# EAGLE design Flowmeter_lpc1113 (EAGLE 6.3)

## Sheet 1 of 2
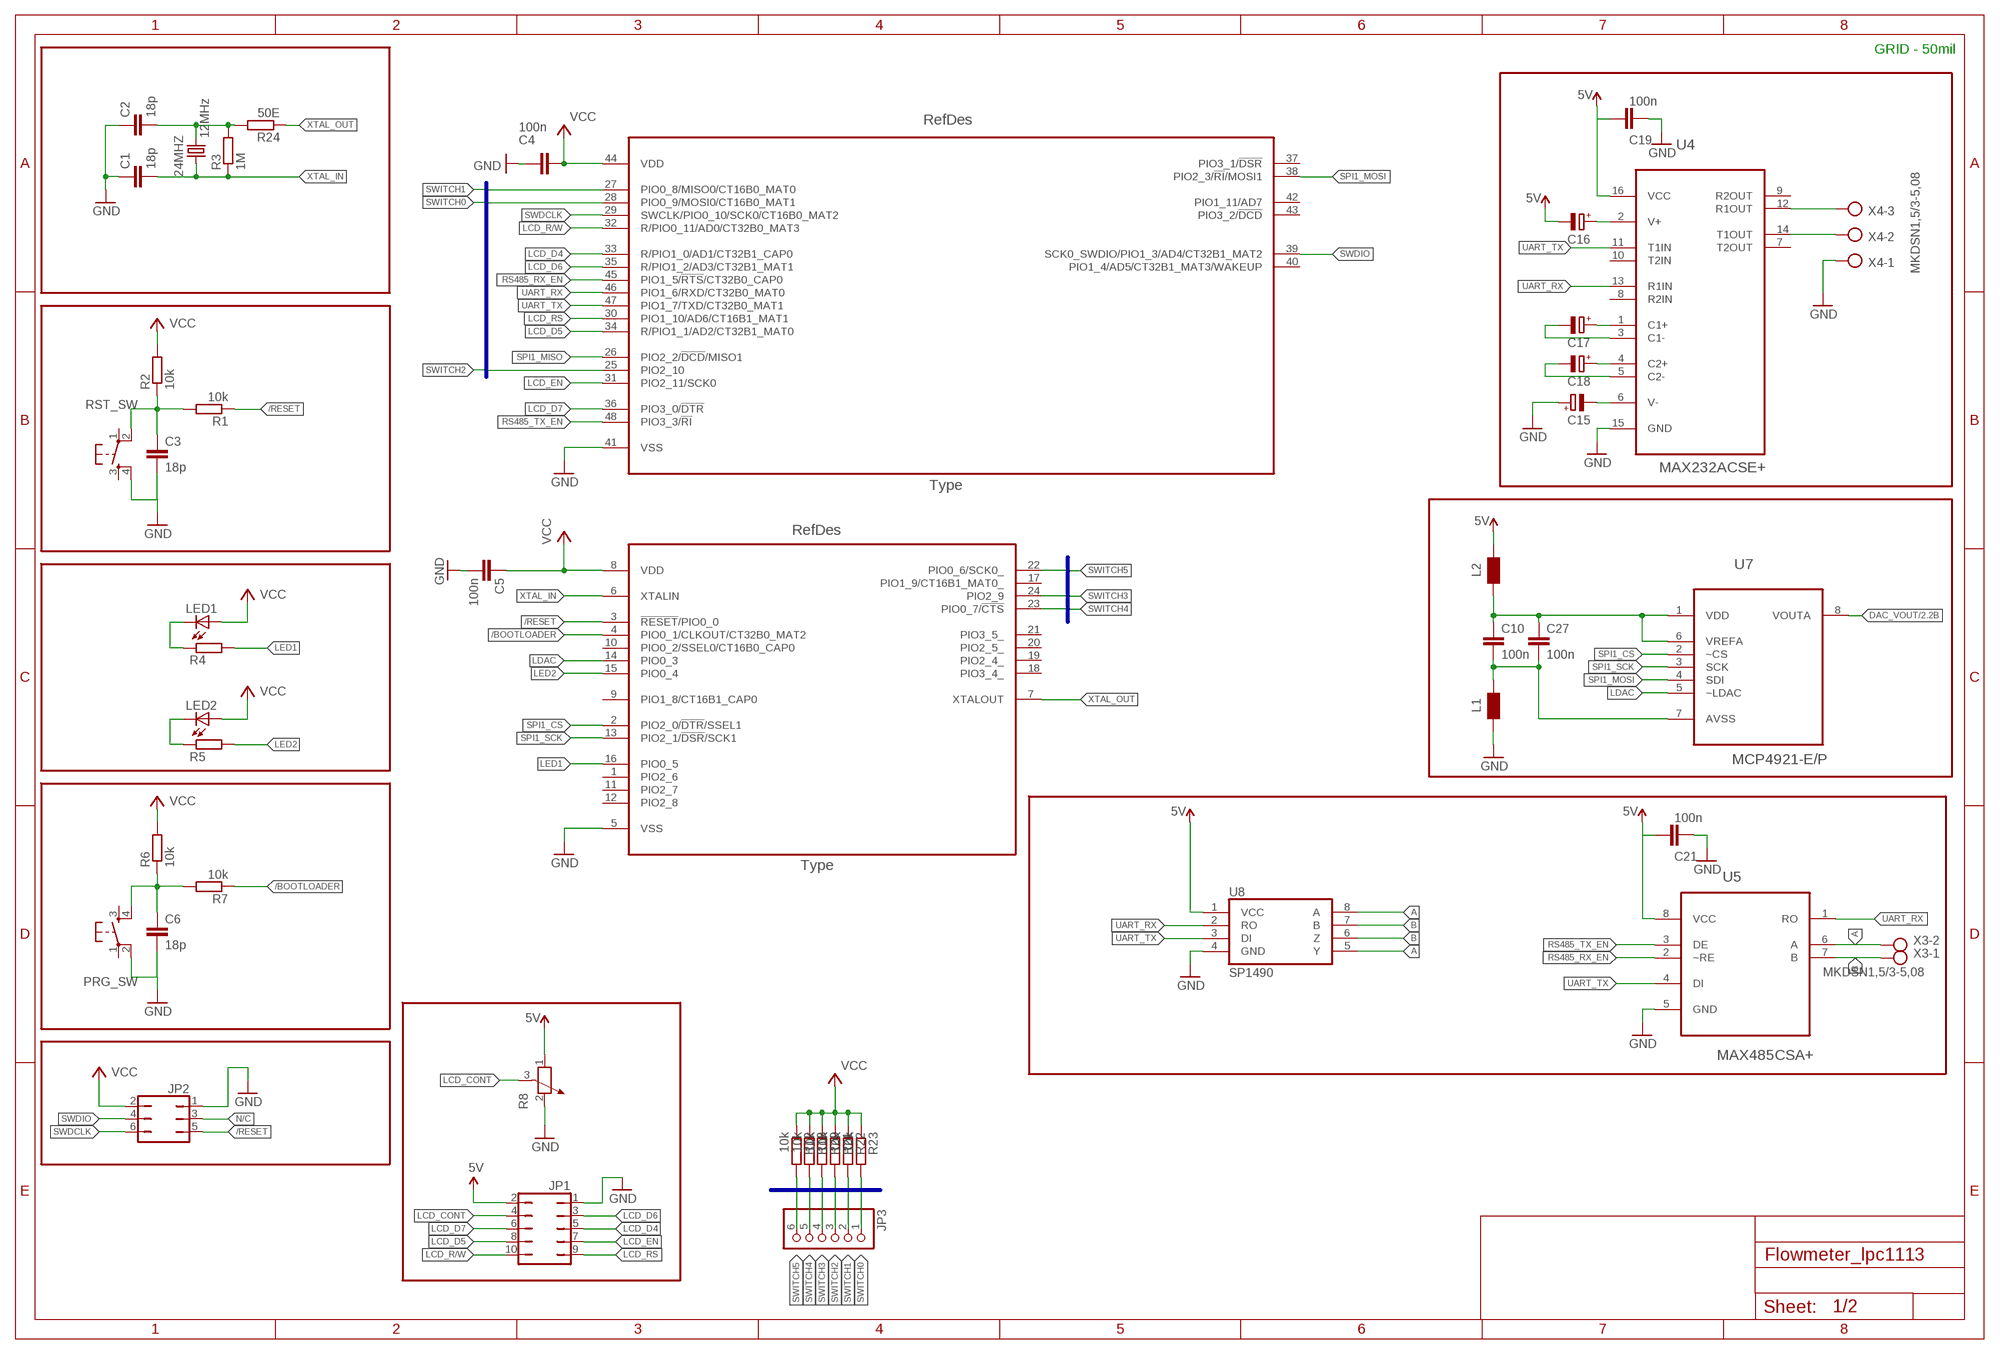
[diagram p0: schematic, sheet 1]

### Parts
24MHZ  12MHz  CRYSTALSMD  [HC49UP]
C1  18p  C-EUC0805K  [C0805K]
C2  18p  C-EUC0805K  [C0805K]
C3  18p  C-EUC0805K  [C0805K]
C4  100n  C-EUC0805K  [C0805K]
C5  100n  C-EUC0805K  [C0805K]
C6  18p  C-EUC0805K  [C0805K]
C10  100n  C-EUC0805K  [C0805K]
C15  CPOL-EUCT3528  [CT3528]
C16  CPOL-EUCT3528  [CT3528]
C17  CPOL-EUCT3528  [CT3528]
C18  CPOL-EUCT3528  [CT3528]
C19  100n  C-EUC0805K  [C0805K]
C21  100n  C-EUC0805K  [C0805K]
C27  100n  C-EUC0805K  [C0805K]
JP1  JP5Q  [JP5Q]
JP2  JP3Q  [JP3Q]
JP3  PINHD-1X6  [1X06]
L1  WURTH ELEKTRONIK - 742792095  WE-CBF_0805  [0805]
L2  WURTH ELEKTRONIK - 742792095  WE-CBF_0805  [0805]
LED1  LEDCHIP-LED0805  [CHIP-LED0805]
LED2  LEDCHIP-LED0805  [CHIP-LED0805]
PRG_SW  TAC_SWITCHPTH  [TACTILE-PTH]
R1  10k  R-EU_R0805W  [R0805W]
R2  10k  R-EU_R0805W  [R0805W]
R3  1M  R-EU_R0805W  [R0805W]
R4  R-EU_R0805  [R0805]
R5  R-EU_R0805  [R0805]
R6  10k  R-EU_R0805W  [R0805W]
R7  10k  R-EU_R0805W  [R0805W]
R8  POTENTIOMETER_PT-10S  [PT-10S]
R12  10k  R-EU_R0805W  [R0805W]
R13  10k  R-EU_R0805W  [R0805W]
R20  10k  R-EU_R0805W  [R0805W]
R21  10k  R-EU_R0805W  [R0805W]
R22  10k  R-EU_R0805W  [R0805W]
R23  10k  R-EU_R0805W  [R0805W]
R24  50E  R-EU_R0805W  [R0805W]
RST_SW  TAC_SWITCHPTH  [TACTILE-PTH]
U1  LPC1113FBD48/302,1  [QFP50P900X900X160-48N]
U4  MAX232ACSE+  [SOIC127P600X175-16N]
U5  MAX485CSA+  [SOIC127P600X175-8N]
U7  MCP4921-E/P  [DIP254P762X432-8]
U8  SP1490  [SO-08]
X3  MKDSN1,5/3-5,08  [MKDSN1,5/3-5,08]
X4  MKDSN1,5/3-5,08  [MKDSN1,5/3-5,08]

### Nets
5V: C16.- C19.2 C21.2 JP1.2 L2.2 R8.1 U4.16(VCC) U5.8(VCC) U8.1(VCC) ; also sheet 2
/BOOTLOADER: R7.1 U1.4(A:PIO0_1/CLKOUT/CT32B0_MAT2)
/RESET: JP2.5 R1.1 U1.3(A:!RESET!/PIO0_0)
A: U5.6(A) U8.5(Y) U8.8(A) X3.2
B: U5.7(B) U8.6(Z) U8.7(B) X3.1
DAC_VOUT: U7.8(VOUTA) ; also sheet 2
GND: C1.1 C2.1 C3.2 C4.2 C5.2 C6.2 C15.+ C19.1 C21.1 JP1.1 JP2.1 L1.1 PRG_SW.2 R8.2 RST_SW.4 U1.5(A:VSS) U1.41(B:VSS) U4.15(GND) U5.5(GND) U8.4(GND) X4.1 ; also sheet 2
GND1: C10.2 C27.2 L1.2 U7.7(AVSS)
LCD_CONT: JP1.4 R8.3
LCD_D4: JP1.5 U1.33(B:R/PIO1_0/AD1/CT32B1_CAP0)
LCD_D5: JP1.8 U1.34(B:R/PIO1_1/AD2/CT32B1_MAT0)
LCD_D6: JP1.3 U1.35(B:R/PIO1_2/AD3/CT32B1_MAT1)
LCD_D7: JP1.6 U1.36(B:PIO3_0/!DTR!)
LCD_EN: JP1.7 U1.31(B:PIO2_11/SCK0)
LCD_R/W: JP1.10 U1.32(B:R/PIO0_11/AD0/CT32B0_MAT3)
LCD_RS: JP1.9 U1.30(B:PIO1_10/AD6/CT16B1_MAT1)
LDAC: U1.14(A:PIO0_3) U7.5(~LDAC)
LED1: R4.2 U1.16(A:PIO0_5)
LED2: R5.2 U1.15(A:PIO0_4)
N$1: LED1.C R4.1
N$2: LED2.C R5.1
N$4: C3.1 R1.2 R2.1 RST_SW.2
N$5: C6.1 PRG_SW.4 R6.1 R7.2
N$6: 24MHZ.2 C2.2 R3.2 R24.2
N$11: C10.1 C27.1 L2.1 U7.1(VDD) U7.6(VREFA)
N$12: U4.14(T1OUT) X4.2
N$13: U4.12(R1OUT) X4.3
N$14: C17.+ U4.1(C1+)
N$24: C17.- U4.3(C1-)
N$26: C18.+ U4.4(C2+)
N$27: C18.- U4.5(C2-)
N$28: C16.+ U4.2(V+)
N$29: C15.- U4.6(V-)
N/C: JP2.3
RS485_RX_EN: U1.45(B:PIO1_5/!RTS!/CT32B0_CAP0) U5.2(~RE)
RS485_TX_EN: U1.48(B:PIO3_3/!RI!) U5.3(DE)
SPI1_CS: U1.2(A:PIO2_0/!DTR!/SSEL1) U7.2(~CS)
SPI1_MISO: U1.26(B:PIO2_2/!DCD!/MISO1)
SPI1_MOSI: U1.38(B:PIO2_3/!RI!/MOSI1) U7.4(SDI)
SPI1_SCK: U1.13(A:PIO2_1/!DSR!/SCK1) U7.3(SCK)
SWDCLK: JP2.6 U1.29(B:SWCLK/PIO0_10/SCK0/CT16B0_MAT2)
SWDIO: JP2.4 U1.39(B:SCK0_SWDIO/PIO1_3/AD4/CT32B1_MAT2)
SWITCH0: JP3.1 R23.2 U1.28(B:PIO0_9/MOSI0/CT16B0_MAT1)
SWITCH1: JP3.2 R22.2 U1.27(B:PIO0_8/MISO0/CT16B0_MAT0)
SWITCH2: JP3.3 R21.2 U1.25(B:PIO2_10)
SWITCH3: JP3.4 R20.2 U1.24(A:PIO2_9)
SWITCH4: JP3.5 R13.2 U1.23(A:PIO0_7/!CTS!)
SWITCH5: JP3.6 R12.2 U1.22(A:PIO0_6/SCK0_)
UART_RX: U1.46(B:PIO1_6/RXD/CT32B0_MAT0) U4.13(R1IN) U5.1(RO) U8.2(RO)
UART_TX: U1.47(B:PIO1_7/TXD/CT32B0_MAT1) U4.11(T1IN) U5.4(DI) U8.3(DI)
VCC: C4.1 C5.1 JP2.2 LED1.A LED2.A R2.2 R6.2 R12.1 R13.1 R20.1 R21.1 R22.1 R23.1 U1.8(A:VDD) U1.44(B:VDD) ; also sheet 2
XTAL_IN: 24MHZ.1 C1.2 R3.1 U1.6(A:XTALIN)
XTAL_OUT: R24.1 U1.7(A:XTALOUT)
Unconnected: PRG_SW.1 PRG_SW.3 RST_SW.1 RST_SW.3 U1.1(A:PIO2_6) U1.9(A:PIO1_8/CT16B1_CAP0) U1.10(A:PIO0_2/SSEL0/CT16B0_CAP0) U1.11(A:PIO2_7) U1.12(A:PIO2_8) U1.17(A:PIO1_9/CT16B1_MAT0_) U1.18(A:PIO3_4_) U1.19(A:PIO2_4_) U1.20(A:PIO2_5_) U1.21(A:PIO3_5_) U1.37(B:PIO3_1/!DSR!) U1.40(B:PIO1_4/AD5/CT32B1_MAT3/WAKEUP) U1.42(B:PIO1_11/AD7) U1.43(B:PIO3_2/!DCD!) U4.7(T2OUT) U4.8(R2IN) U4.9(R2OUT) U4.10(T2IN)

### Buses
SWITCH[0..5]

### Notes on the sheet
- GRID - 50mil

## Sheet 2 of 2
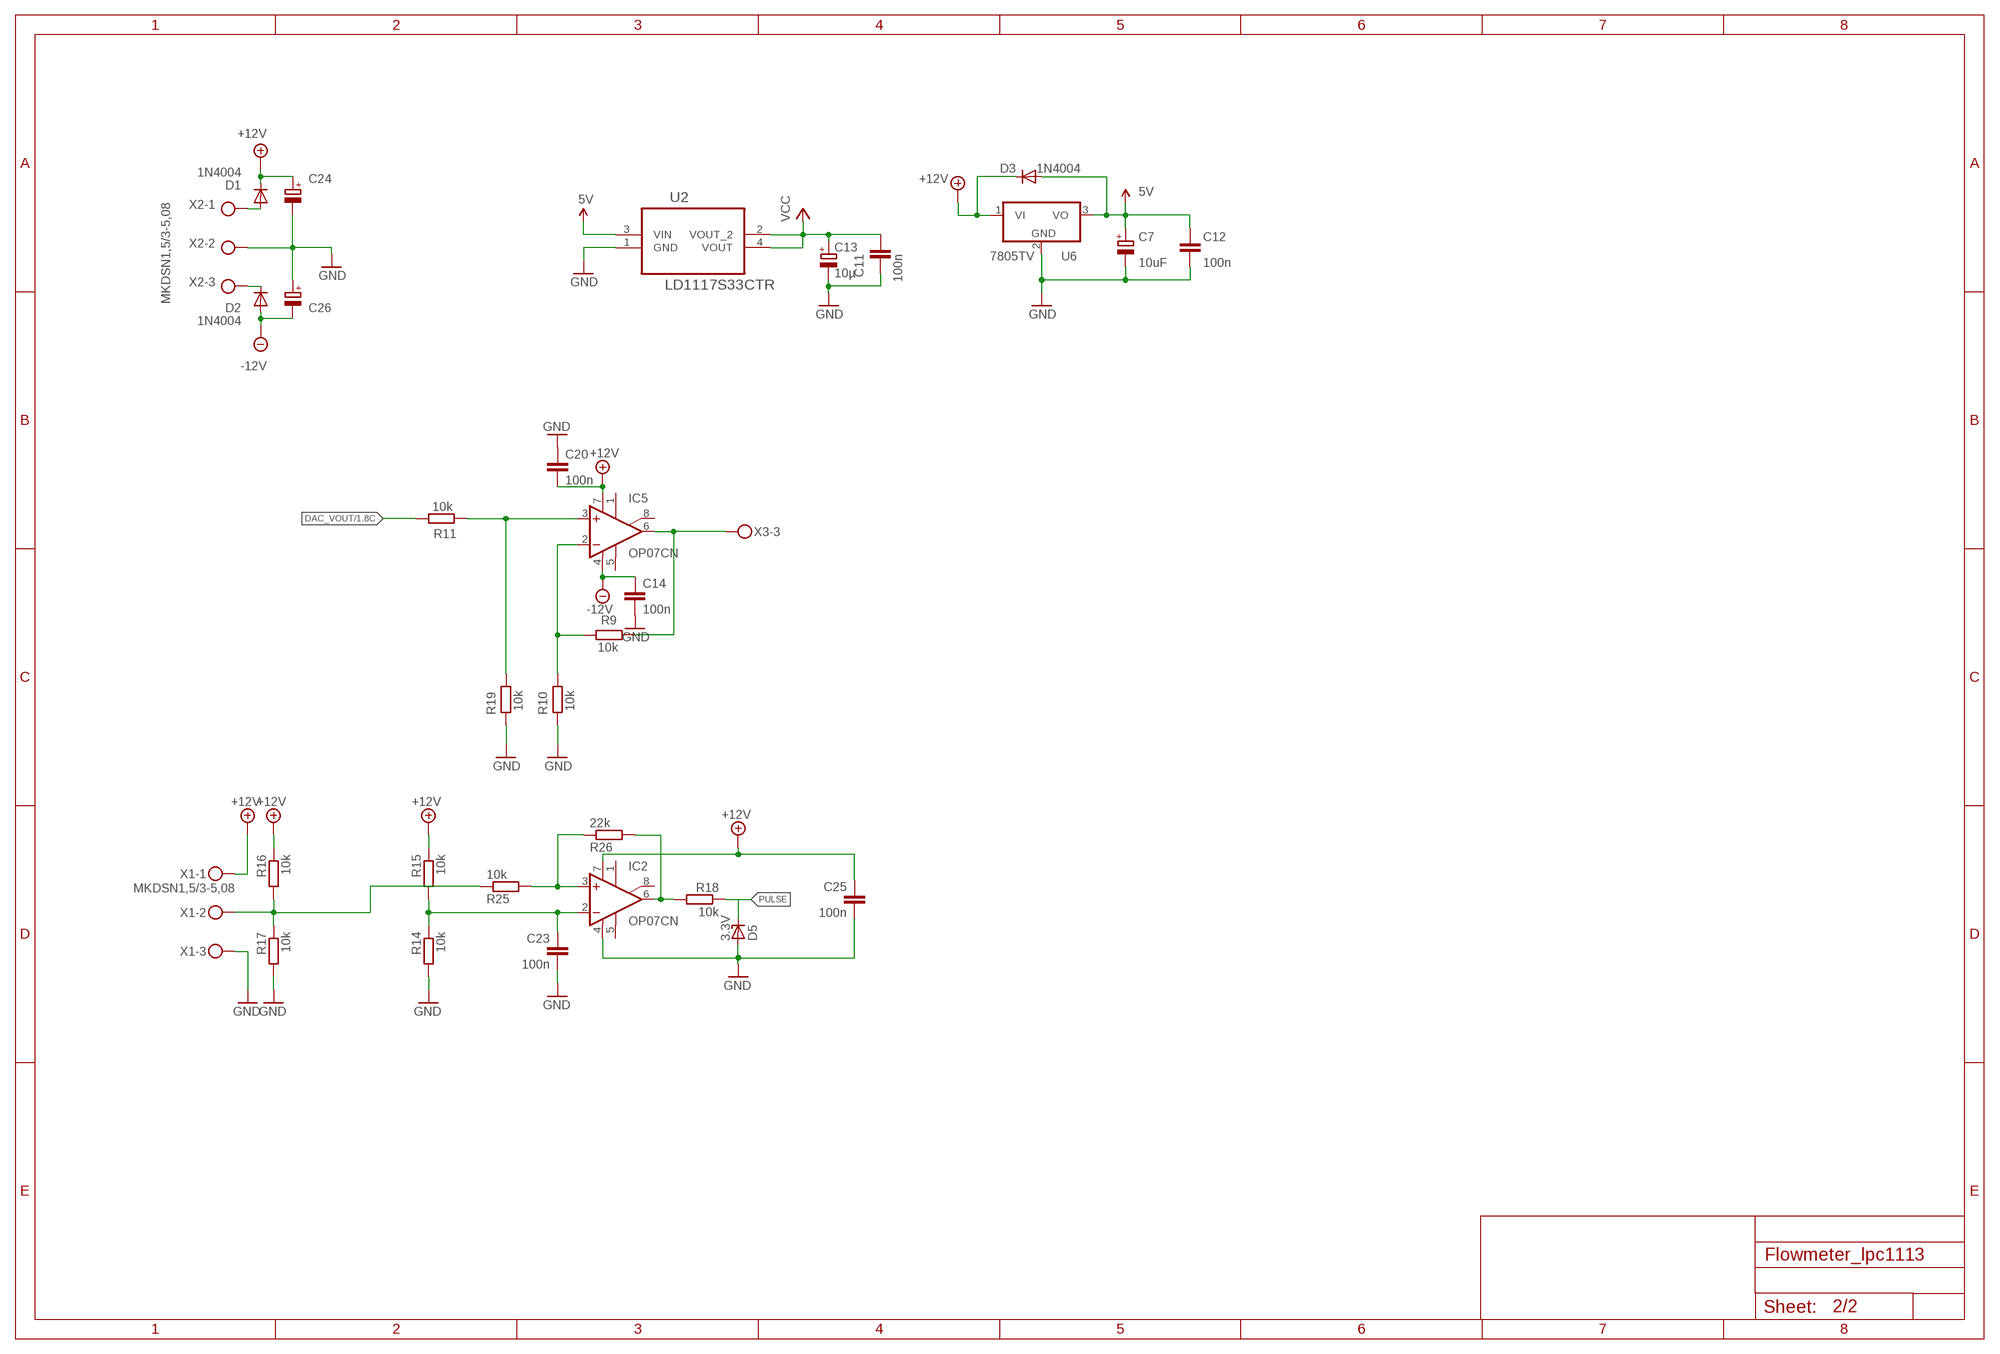
[diagram p1: schematic, sheet 2]

### Parts
C7  10uF  CPOL-EUE5-6  [E5-6]
C11  100n  C-EUC0805K  [C0805K]
C12  100n  C-EUC0805K  [C0805K]
C13  10µ  CPOL-EUCT3528  [CT3528]
C14  100n  C-EUC0805K  [C0805K]
C20  100n  C-EUC0805K  [C0805K]
C23  100n  C-EUC0805K  [C0805K]
C24  100uF/60V  CPOL-EUE5-6  [E5-6]
C25  100n  C-EUC0805K  [C0805K]
C26  100uF/60V  CPOL-EUE5-6  [E5-6]
D1  1N4004  [DO41-10]
D2  1N4004  [DO41-10]
D3  1N4004  [DO41-10]
D5  3.3V  ZENER_DIODEDO41Z10  [DO41Z10]
IC2  OP07CN  [DIL08]
IC5  OP07CN  [DIL08]
R9  10k  R-EU_0207/10  [0207/10]
R10  10k  R-EU_0207/10  [0207/10]
R11  10k  R-EU_0207/10  [0207/10]
R14  10k  R-EU_R0805W  [R0805W]
R15  10k  R-EU_R0805W  [R0805W]
R16  10k  R-EU_R0805W  [R0805W]
R17  10k  R-EU_R0805W  [R0805W]
R18  10k  R-EU_R0805W  [R0805W]
R19  10k  R-EU_0207/10  [0207/10]
R25  10k  R-EU_R0805W  [R0805W]
R26  22k  R-EU_R0805W  [R0805W]
U2  LD1117S33CTR  [SOT230P700X180-4N]
U6  7805TV  [TO220V]
X1  MKDSN1,5/3-5,08  [MKDSN1,5/3-5,08]
X2  MKDSN1,5/3-5,08  [MKDSN1,5/3-5,08]

### Nets
5V: C7.+ C12.2 D3.A U2.3(VIN) U6.3(VO) ; also sheet 1
+12V: C20.2 C24.+ C25.1 D1.C D3.C IC2.7(V+) IC5.7(V+) R15.1 R16.1 U6.1(VI) X1.1
-12V: C14.1 C26.- D2.A IC5.4(V-)
DAC_VOUT: R11.2 ; also sheet 1
GND: C7.- C11.1 C12.1 C13.- C14.2 C20.1 C23.2 C24.- C25.2 C26.+ D5.A(ANODE) IC2.4(V-) R10.1 R14.2 R17.2 R19.1 U2.1(GND) U6.2(GND) X1.3 X2.2 ; also sheet 1
N$7: IC2.3(+IN) R25.2 R26.1
N$15: C23.1 IC2.2(-IN) R14.1 R15.2
N$16: IC5.2(-IN) R9.1 R10.2
N$17: IC5.3(+IN) R11.1 R19.2
N$20: D2.C X2.3
N$21: D1.A X2.1
N$33: IC5.6(OUT) R9.2 X3.3
N$37: IC2.6(OUT) R18.2 R26.2
PULSE: D5.C(CATHODE) R18.1
SENSOR_SIGNAL: R16.2 R17.1 R25.1 X1.2
VCC: C11.2 C13.+ U2.2(VOUT_2) U2.4(VOUT) ; also sheet 1
Unconnected: IC2.1(ON1) IC2.5(OPT) IC2.8(ON2) IC5.1(ON1) IC5.5(OPT) IC5.8(ON2)

## Library data of the parts
24MHZ = SparkFun2:CRYSTAL: Crystals Various standard crystals. Proven footprints. Spark Fun Electronics SKU : Comp-XTAL
C1-C6 C10-C12 C14 C19-C21 C23 C25 C27 = rcl:C-EU: CAPACITOR, European symbol
C7 C13 C15-C18 C24 C26 = rcl:CPOL-EU: POLARIZED CAPACITOR, European symbol
D1-D3 = diode:1N4004: DIODE general purpose rectifier, 1 A
D5 = ng:ZENER_DIODE: zener diode
IC2 IC5 = linear:OP07*: OP AMP
JP1 = jumper:JP5Q: JUMPER
JP2 = jumper:JP3Q: JUMPER
JP3 = pinhead:PINHD-1X6: PIN HEADER
L1 L2 = wuerth-elektronik:WE-CBF: SMD EMI Suppression Ferrite Beads - excellent anti-EMI properties - low DCR - impedances till 3000 ohms - rated current up to 6 A
LED1 LED2 = led:LED: LED OSRAM: - CHIPLED LG R971, LG N971, LY N971, LG Q971, LY Q971, LO R971, LY R971 LH N974, LH R974 LS Q976, LO Q976, LY Q976 LO Q996 - Hyper CHIPLED LW Q18S LB Q993, LB Q99A, LB R99A - SideLED LS A670, LO A670, LY A670, LG A670, LP A670 LB A673, LV A673, LT A673, LW A673 LH A674 LY A675 LS A676, LA A676, LO A676, LY A676, LW A676 LS A679, LY A679, LG A679 - Hyper Micro SIDELED® LS Y876, LA Y876, LO Y876, LY Y876 LT Y87S - SmartLED LW L88C, LW L88S LB L89C, LB L89S, LG L890 LS L89K, LO L89K, LY L89K LS L896, LA L896, LO L896, LY L896 - TOPLED LS T670, LO T670, LY T670, LG T670, LP T670 LSG T670, LSP T670, LSY T670, LOP T670, LYG T670 LG T671, LOG T671, LSG T671 LB T673, LV T673, LT T673, LW T673 LH T674 LS T676, LA T676, LO T676, LY T676, LB T676, LH T676, LSB T676, LW T676 LB T67C, LV T67C, LT T67C, LS T67K, LO T67K, LY T67K, LW E67C LS E67B, LA E67B, LO E67B, LY E67B, LB E67C, LV E67C, LT E67C LW T67C LS T679, LY T679, LG T679 LS T770, LO T770, LY T770, LG T770, LP T770 LB T773, LV T773, LT T773, LW T773 LH T774 LS E675, LA E675, LY E675, LS T675 LS T776, LA T776, LO T776, LY T776, LB T776 LHGB T686 LT T68C, LB T68C - Hyper Mini TOPLED® LB M676 - Mini TOPLED Santana® LG M470 LS M47K, LO M47K, LY M47K Source: http://www.osram.convergy.de LUXEON: - LUMILED® LXK2-PW12-R00, LXK2-PW12-S00, LXK2-PW14-U00, LXK2-PW14-V00 LXK2-PM12-R00, LXK2-PM12-S00, LXK2-PM14-U00 LXK2-PE12-Q00, LXK2-PE12-R00, LXK2-PE12-S00, LXK2-PE14-T00, LXK2-PE14-U00 LXK2-PB12-K00, LXK2-PB12-L00, LXK2-PB12-M00, LXK2-PB14-N00, LXK2-PB14-P00, LXK2-PB14-Q00 LXK2-PR12-L00, LXK2-PR12-M00, LXK2-PR14-Q00, LXK2-PR14-R00 LXK2-PD12-Q00, LXK2-PD12-R00, LXK2-PD12-S00 LXK2-PH12-R00, LXK2-PH12-S00 LXK2-PL12-P00, LXK2-PL12-Q00, LXK2-PL12-R00 Source: www.luxeon.com KINGBRIGHT: KA-3528ASYC Source: www.kingbright.com
PRG_SW RST_SW = SparkFun1:TAC_SWITCH: Momentary Switch Button commonly used for reset or general input. Spark Fun Electronics SKU : COM-00097
R1-R7 R12-R18 R20-R26 = rcl:R-EU_: RESISTOR, European symbol
R8 = rcl:POTENTIOMETER_: Potentiometer
R9-R11 R19 = resistor:R-EU_: RESISTOR, European symbol
U1 = lpc1113:LPC1113FBD48/302,1: Embedded - Microcontrollers,LQFP-48; MPN: LPC1113FBD48/302,1; OC_FARNELL: 2072186; OC_NEWARK: 83T7137; PACKAGE: LQFP-48; SUPPLIER: NXP
U2 = ld1117:LD1117S33CTR: V REG, 1VDO, 0.8A, 3.3V, 4%, 3SOT223; MPN: LD1117S33CTR; OC_FARNELL: 2253482; OC_NEWARK: 89K0626; PACKAGE: SOT223-3; SUPPLIER: STMicroelectronics
U4 = maxim:MAX232ACSE+: +5V-Powered, Multichannel RS-232 Drivers/Receivers; MPN: MAX232ACSE+; OC_FARNELL: 9724362; OC_NEWARK: 52K5506; PACKAGE: SOIC-16; SUPPLIER: Maxim
U5 = maxim:MAX485CSA+: ±15kV ESD-Protected, Slew-Rate-Limited, Low-Power, RS-485/RS-422 Transceivers; MPN: MAX485CSA+; OC_FARNELL: 9725954; OC_NEWARK: 68K4795; PACKAGE: SOIC-8; SUPPLIER: Maxim
U6 = linear:78*: Positive VOLTAGE REGULATOR Source: http://cache.national.com/ds/LM/LM78L05.pdf http://www.fairchildsemi.com/ds/LM/LM7805.pdf
U7 = microchip:MCP4921-E/P: DAC; MPN: MCP4921-E/P; OC_FARNELL: 1332112; OC_NEWARK: 08J8743; PACKAGE: DIP-8; SUPPLIER: Microchip
U8 = exar:SP1490: Full Duplex RS-485 Transceiver
X1-X4 = con-phoenix-508:MKDSN1,5/3-5,08: MKDSN 1,5/ 3-5,08 Printklemme Nennstrom: 13,5 A Nennspannung: 250 V Rastermaß: 5,08 mm Polzahl: 3 Anschlussart: Schraubanschluss Montage: Löten Anschlussrichtung Leiter/Platine: 0 ° Artikelnummer: 1729131 Source: http://eshop.phoenixcontact.com .. 1729131.pdf; MPN: SMKDSN1,5/3-5,08; OC_FARNELL: 1792904; OC_NEWARK: 70R0299

## Board
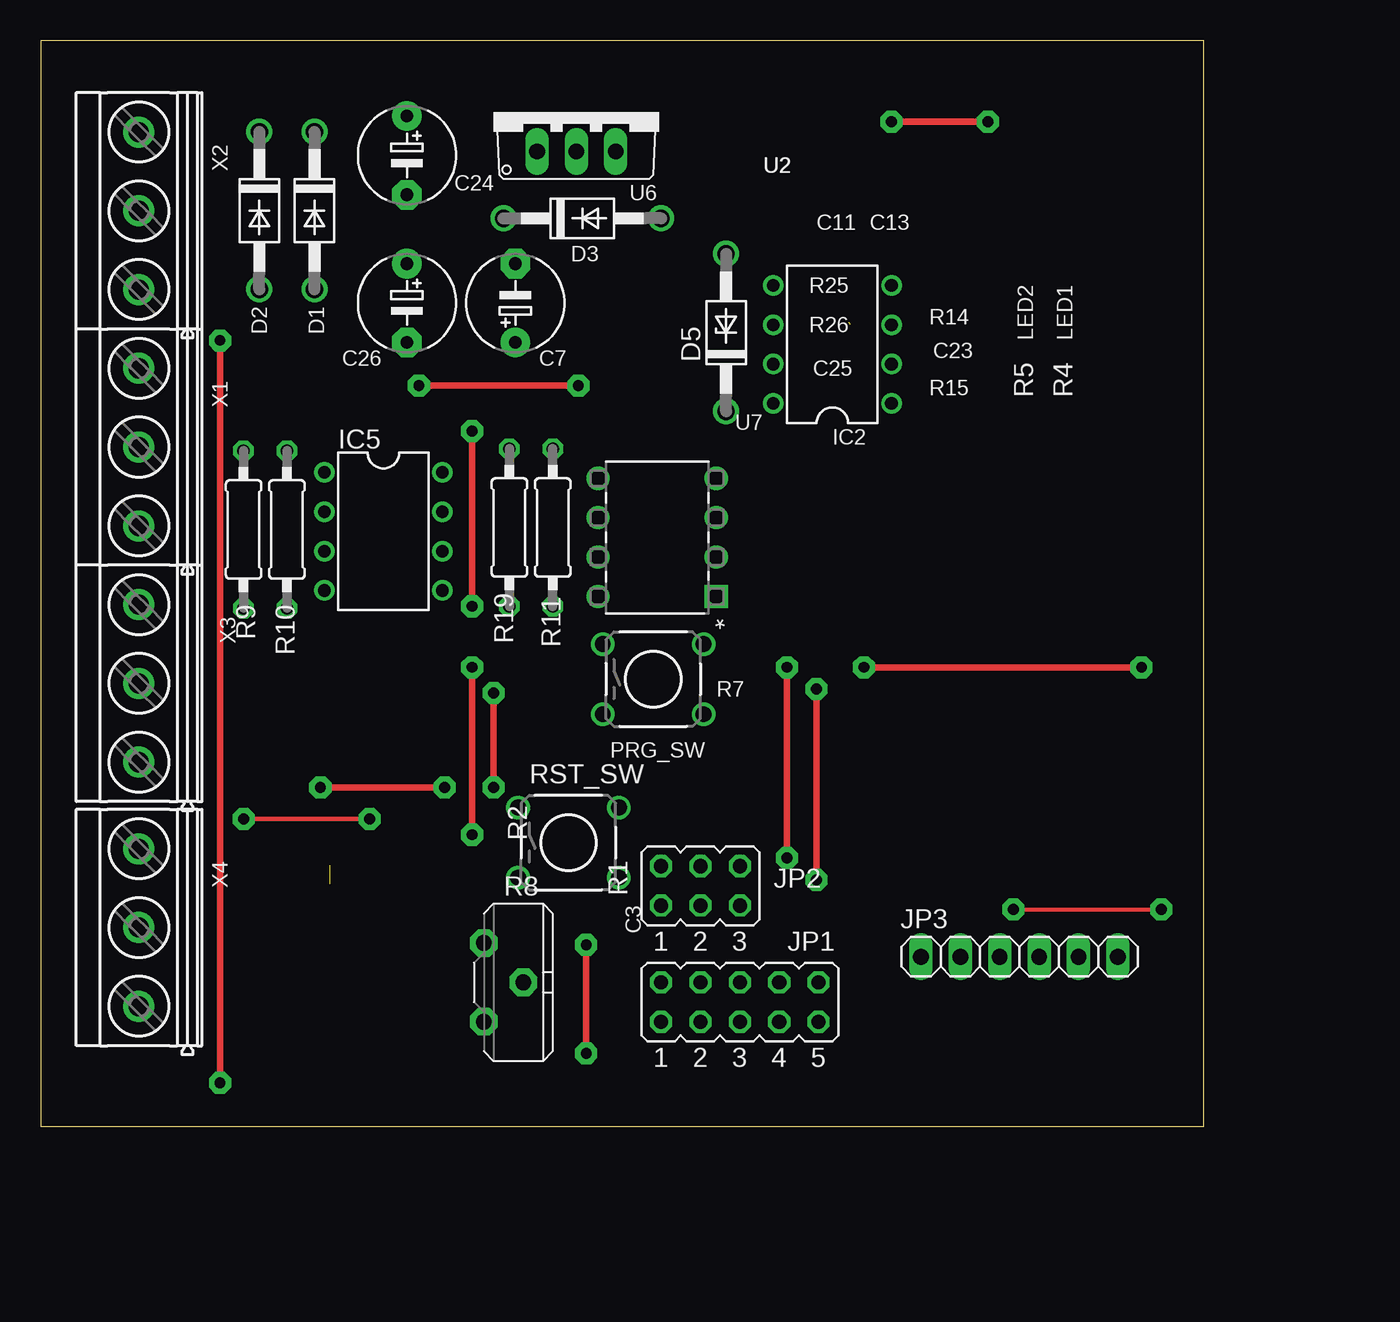
[diagram p2: board, top side]
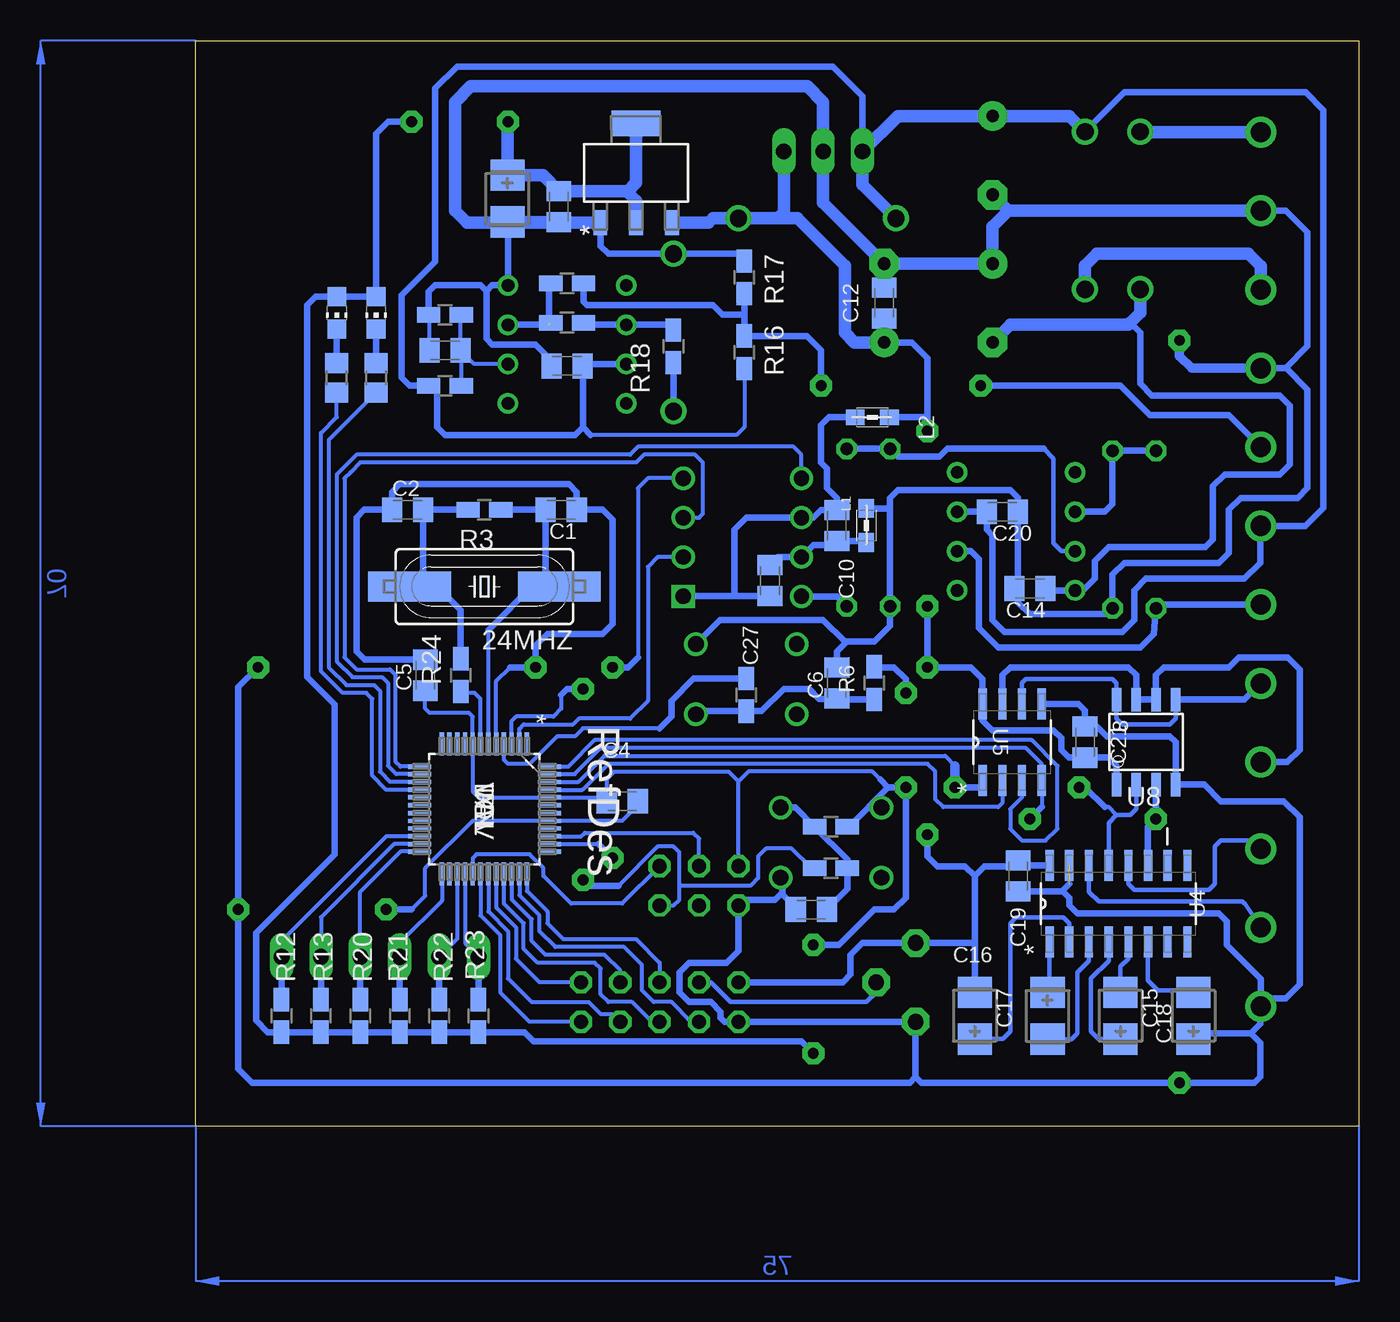
[diagram p3: board, bottom side, seen from below]

Size 75 x 70 mm. Coordinates in mm from the lower left corner, seen from the top.
Outline: 0,0 75,0 75,70 0,70 0,0
Copper layers (1*16): Top 0.035mm / dielectric 1.5mm / Bottom 0.035mm
Design rules "default *": minimum track width 16mil, minimum drill 24mil, track to track 12mil, track to pad 12mil, pad to pad 12mil, via to via 12mil, smd to smd 12mil, copper to edge 40mil, drill to drill 8mil, minimum pad ring 10mil, minimum via ring 8mil, stop-mask expansion 4mil, vias tented up to drill 0mil, thermal gap 10mil

### Footprints (pad centres in the part's own frame; a part is rotated, then mirrored left to right if it is on the bottom)
HC49UP = smd 5.334 x 1.93: 1 -4.826,0; 2 4.826,0
C0805K = smd 1.3 x 1.6: 1 -1,0; 2 1,0
E5-6 = drill 0.813 pad 1.905: + -2.54,0 | drill 0.813 pad 1.905 octagon: - 2.54,0
CT3528 = smd 2 x 2.2: + -1.5,0; - 1.5,0
DO41-10 = drill 1.118: A 5.08,0; C -5.08,0
DO41Z10 = drill 1.118: A 5.08,0; C -5.08,0
DIL08 = drill 0.813 pad 1.27: 1 -3.81,-3.81; 2 -1.27,-3.81; 3 1.27,-3.81; 4 3.81,-3.81; 5 3.81,3.81; 6 1.27,3.81; 7 -1.27,3.81; 8 -3.81,3.81
JP5Q = drill 0.914 octagon: 1 -5.08,-1.27; 2 -5.08,1.27; 3 -2.54,-1.27; 4 -2.54,1.27; 5 0,-1.27; 6 0,1.27; 7 2.54,-1.27; 8 2.54,1.27; 9 5.08,-1.27; 10 5.08,1.27
JP3Q = drill 0.914 octagon: 1 -2.54,-1.27; 2 -2.54,1.27; 3 0,-1.27; 4 0,1.27; 5 2.54,-1.27; 6 2.54,1.27
1X06 = drill 1.016 long: 1 -6.35,0; 2 -3.81,0; 3 -1.27,0; 4 1.27,0; 5 3.81,0; 6 6.35,0
0805 = smd 1.2 x 1: 1 -1.1,0; 2 1.1,0
CHIP-LED0805 = smd 1.2 x 1.2: A 0,-1.05; C 0,1.05
TACTILE-PTH = drill 1.016: 1 -3.251,2.261; 2 3.251,2.261; 3 -3.251,-2.261; 4 3.251,-2.261
R0805W = smd 1.5 x 1: 1 -1.052,0; 2 1.052,0
R0805 = smd 1.3 x 1.5: 1 -0.95,0; 2 0.95,0
PT-10S = drill 1.016 pad 1.778 octagon: 1 -2.54,-1.27; 2 2.54,-1.27; 3 0,1.27
0207/10 = drill 0.813 octagon: 1 -5.08,0; 2 5.08,0
QFP50P900X900X160-48N = smd 1.473 x 0.279: 1 -4.191,2.743; 2 -4.191,2.261; 3 -4.191,1.753; 4 -4.191,1.245; 5 -4.191,0.762; 6 -4.191,0.254; 7 -4.191,-0.254; 8 -4.191,-0.762; 9 -4.191,-1.245; 10 -4.191,-1.753; 11 -4.191,-2.261; 12 -4.191,-2.743; 25 4.191,-2.743; 26 4.191,-2.261; 27 4.191,-1.753; 28 4.191,-1.245; 29 4.191,-0.762; 30 4.191,-0.254; 31 4.191,0.254; 32 4.191,0.762; 33 4.191,1.245; 34 4.191,1.753; 35 4.191,2.261; 36 4.191,2.743 | smd 0.279 x 1.473: 13 -2.743,-4.191; 14 -2.261,-4.191; 15 -1.753,-4.191; 16 -1.245,-4.191; 17 -0.762,-4.191; 18 -0.254,-4.191; 19 0.254,-4.191; 20 0.762,-4.191; 21 1.245,-4.191; 22 1.753,-4.191; 23 2.261,-4.191; 24 2.743,-4.191; 37 2.743,4.191; 38 2.261,4.191; 39 1.753,4.191; 40 1.245,4.191; 41 0.762,4.191; 42 0.254,4.191; 43 -0.254,4.191; 44 -0.762,4.191; 45 -1.245,4.191; 46 -1.753,4.191; 47 -2.261,4.191; 48 -2.743,4.191
SOT230P700X180-4N = smd 1.626 x 0.889: 1 -3.2,2.311; 2 -3.2,0; 3 -3.2,-2.311 | smd 1.626 x 3.175: 4 3.2,0
SOIC127P600X175-16N = smd 1.981 x 0.533: 1 -2.464,4.445; 2 -2.464,3.175; 3 -2.464,1.905; 4 -2.464,0.635; 5 -2.464,-0.635; 6 -2.464,-1.905; 7 -2.464,-3.175; 8 -2.464,-4.445; 9 2.464,-4.445; 10 2.464,-3.175; 11 2.464,-1.905; 12 2.464,-0.635; 13 2.464,0.635; 14 2.464,1.905; 15 2.464,3.175; 16 2.464,4.445
SOIC127P600X175-8N = smd 1.981 x 0.533: 1 -2.464,1.905; 2 -2.464,0.635; 3 -2.464,-0.635; 4 -2.464,-1.905; 5 2.464,-1.905; 6 2.464,-0.635; 7 2.464,0.635; 8 2.464,1.905
TO220V = drill 1.016 long: 1 -2.54,-2.54; 2 0,-2.54; 3 2.54,-2.54
DIP254P762X432-8 = drill 0.991 square: 1 -7.62,7.62 | drill 0.991: 2 -7.62,5.08; 3 -7.62,2.54; 4 -7.62,0; 5 0,0; 6 0,2.54; 7 0,5.08; 8 0,7.62
SO-08 = smd 0.61 x 1.524: 1 -1.27,-2.743; 2 0,-2.743; 3 1.27,-2.743; 4 2.54,-2.743; 5 2.54,2.743; 6 1.27,2.743; 7 0,2.743; 8 -1.27,2.743
MKDSN1,5/3-5,08 = drill 1.3 pad 2: 1 -7.641,0.025; 2 -2.561,0.025; 3 2.519,0.025

### Placement (x,y rotation side)
24MHZ  56.39,34.8 180 bottom
C1  51.44,39.75 180 bottom
C2  61.34,39.75 0 bottom
C3  35.31,13.97 180 bottom
C4  47.5,20.95 0 bottom
C5  60.2,29.08 90 bottom
C6  33.66,28.57 90 bottom
C7  30.61,53.09 90 top
C10  33.66,38.73 270 bottom
C11  51.59,59.31 90 bottom
C12  30.61,53.09 270 bottom
C13  54.9,59.82 270 bottom
C14  21.21,34.67 180 bottom
C15  10.67,7.11 90 bottom
C16  24.77,7.11 90 bottom
C17  20.07,7.11 270 bottom
C18  15.37,7.11 90 bottom
C19  21.97,16.13 90 bottom
C20  22.99,39.62 180 bottom
C21  17.65,24.77 270 bottom
C23  58.93,50.04 180 bottom
C24  23.62,62.61 270 top
C25  51.05,49.02 180 bottom
C26  23.62,53.09 270 top
C27  37.97,35.18 90 bottom
D1  17.65,59.05 270 top
D2  14.1,59.05 270 top
D3  34.92,58.55 0 top
D5  44.2,51.18 90 top
IC2  51.05,50.42 90 top
IC5  22.1,38.35 270 top
JP1  45.09,8 0 top
JP2  42.55,15.49 0 top
JP3  63.12,10.92 0 top
L1  31.75,38.73 270 bottom
L2  31.37,45.72 0 bottom
LED1  65.91,52.45 180 bottom
LED2  63.37,52.45 180 bottom
PRG_SW  39.5,28.83 0 top
R1  34.04,16.64 0 bottom
R2  34.04,19.3 0 bottom
R3  56.39,39.75 180 bottom
R4  65.91,48.26 270 bottom
R5  63.37,48.26 270 bottom
R6  31.24,28.57 90 bottom
R7  39.5,27.81 270 bottom
R8  29.84,9.27 270 top
R9  13.08,38.48 270 top
R10  15.88,38.48 90 top
R11  33.02,38.61 270 top
R12  69.47,7.11 90 bottom
R13  66.93,7.11 90 bottom
R14  58.93,52.32 180 bottom
R15  58.93,47.75 0 bottom
R16  39.62,49.91 90 bottom
R17  39.62,54.74 90 bottom
R18  44.2,50.29 90 bottom
R19  30.23,38.61 90 top
R20  64.39,7.11 90 bottom
R21  61.85,7.11 90 bottom
R22  59.31,7.11 90 bottom
R23  56.77,7.11 90 bottom
R24  57.91,29.08 90 bottom
R25  51.05,54.36 180 bottom
R26  51.05,51.82 0 bottom
RST_SW  34.04,18.29 0 top
U1  56.39,20.45 270 bottom
U2  46.61,61.47 90 bottom
U4  15.49,14.35 90 bottom
U5  22.35,24.77 90 bottom
U6  34.54,65.41 0 top
U7  35.94,41.78 180 top
U8  14.35,24.77 0 bottom
X1  6.35,46.35 90 top
X2  6.35,61.59 90 top
X3  6.35,31.11 90 top
X4  6.35,15.37 90 top

### Tracks (layer width: path | path; a pad name or v marks a point on that pad's centre or on a via)
5V  (via drill 0.7 pad 1.42)
  Top 0.406: v27.81,18.8 v27.81,29.59 | v27.81,33.53 v27.81,44.83
  Bottom 0.406: C16.- 24.77,11.81 | 24.77,11.81 24.77,16.13 | U8.1 15.62,23.24 16.14,23.77 C21.2 18.68,23.77 19.18,24.26 19.18,25.02 19.68,25.53 23.62,25.53 24.26,26.16 U5.8 24.26,28.83 25.02,29.59 v27.81,29.59 v27.81,33.53 | 24.77,11.81 R8.1 32,11.81 32.77,11.05 32.77,9.78 33.27,9.27 JP1.2 | U4.16 21.66,16.82 C19.2 22.34,16.76 24.13,16.76 24.77,16.13 | 24.77,16.13 25.4,16.76 27.18,16.76 27.81,17.4 v27.81,18.8 | v27.81,44.83 27.81,45.85 | 27.81,45.85 27.81,49.53 28.83,50.55 C7.+ | L2.2 27.94,45.72 27.81,45.85
  Bottom 0.813: C12.2 C7.+ 32.51,50.55 33.15,51.18 33.15,55.5 36.2,58.55 37.47,58.55 | 37.47,58.55 D3.A 41.66,58.55 41.94,58.27 U2.3 | U6.3 37.08,58.93 37.47,58.55
+12V
  Bottom 0.254: 50.04,49.01 C25.1 | R16.1 39.62,45.09 40.13,44.58 49.53,44.58 | 59.44,47.37 59.44,47.75
  Bottom 0.406: D1.C 15.11,66.67 3.43,66.67 2.29,65.53 2.29,39.88 3.45,38.71 X1.1 6.35,38.69 6.35,36.32 7.37,35.31 13.72,35.31 14.48,34.54 14.48,32.64 15.24,31.88 22.86,31.88 23.62,32.64 23.62,38.1 23.99,38.47 C20.2 IC5.7 | IC2.7 49.93,49.15 C25.1 | R15.1 59.98,47.92 59.44,47.37 59.44,45.09 58.93,44.58 50.55,44.58 50.04,45.09 | 50.04,45.09 50.04,49.01 | 49.53,44.58 50.04,45.09 | 59.44,47.75 61.21,47.75 61.72,48.26 61.72,53.59 59.56,55.75 59.56,66.93 58.17,68.33 33.91,68.33 32,66.42 U6.1
  Bottom 0.813: D1.C 18.67,65.15 C24.+ 29.72,65.15 U6.1 32,60.71 D3.C
-12V
  Bottom 0.406: 14.73,51.82 14.1,51.18 14.1,47.88 13.34,47.12 5.08,47.12 4.45,46.48 4.45,42.67 5.08,42.04 8.64,42.04 9.4,41.27 9.4,37.85 9.91,37.34 16.13,37.34 17.02,36.45 17.02,35.31 17.78,34.54 IC5.4 20.08,34.54 C14.1
  Bottom 0.813: D2.A 14.1,52.45 14.73,51.82 14.86,51.69 22.48,51.69 C26.-
/BOOTLOADER
  Bottom 0.254: U1.4 55.14,23.65 54.86,23.37 53.47,23.37 51.69,25.15 50.55,25.15 50.04,25.65 45.09,25.65
  Bottom 0.406: R7.1 42.89,28.87 44.32,27.43 44.32,26.42 45.09,25.65
/RESET  (via drill 0.7 pad 1.42)
  Top 0.406: v50.04,15.88 v50.04,28.19
  Bottom 0.254: 54.61,24.66 U1.3 54.63,26.14 54.36,26.42 51.94,26.42 51.44,26.92 51.44,27.81 | JP2.5 44.2,14.22 43.81,14.61 43.81,15.62 | 43.81,15.62 43.81,17.65 44.2,18.03 45.21,18.03 47.75,15.49 | R1.1 35.31,16.64 36.58,17.91 38.23,17.91 38.73,17.4 38.73,16 39.24,15.49 43.69,15.49 43.81,15.62
  Bottom 0.406: v50.04,15.88 49.66,15.49 47.75,15.49 | v50.04,28.19 51.05,28.19 51.44,27.81
A
  Bottom 0.305: U5.6 21.72,28.57 21.46,28.83 15.88,28.83 15.62,28.57 U8.8 15.62,26.29 15.24,25.91 12.19,25.91 11.81,26.29 U8.5
  Bottom 0.406: U8.5 7.37,27.51 X3.2
B
  Bottom 0.406: U5.7 22.99,29.08 22.48,29.59 14.86,29.59 14.35,29.08 U8.7 U8.6 13.08,29.08 12.57,29.59 8.38,29.59 7.75,30.23 4.57,30.23 3.81,29.46 3.81,24.26 4.59,23.47 X3.1
DAC_VOUT
  Bottom 0.406: U7.8 33.66,34.16 R11.2
GND  (via drill 0.7 pad 1.42)  (1 unrouted)
  Top 0.254: v62.74,13.97 v72.26,13.97
  Top 0.406: v11.56,50.67 v11.56,2.79 | v70.99,29.59 v53.09,29.59
  Bottom 0.254: C4.2 46.5,20.68 47.5,19.68 U1.41 57.15,19.68 60.2,16.64 60.2,14.86 61.09,13.97 | C23.2 59.93,52.27 R14.2 | U1.5 55.63,28.7 54.74,29.59
  Bottom 0.305: 6.35,8.21 X4.1 | 10.29,5.99 C15.+
  Bottom 0.406: 48.9,57.91 U2.1 48.9,58.26 48.9,56.77 48.39,56.26 D5.A 40.1,56.26 R17.2 | 30.23,54.1 C12.1 | 20.4,27.18 U5.5 18.09,27.23 17.65,26.8 C21.1 16.88,25.77 16.26,25.15 12.19,25.15 11.81,24.77 U8.4 9.96,22.02 8.89,20.95 4.83,20.95 3.81,19.94 3.81,9.14 4.7,8.26 6.3,8.26 X4.1 6.33,9.5 8.51,11.68 8.51,13.21 9.02,13.72 18.16,13.72 18.67,14.22 18.67,14.73 19.07,15.13 19.16,15.13 | 6.96,5.99 6.35,6.6 6.35,8.21 | 6.96,5.99 10.29,5.99 | 19.16,15.13 18.67,15.62 | 19.16,15.13 C19.1 | 6.96,5.99 6.35,5.38 6.35,3.17 6.73,2.79 v11.56,2.79 28.19,2.79 28.57,3.17 | 28.57,3.17 R8.2 JP1.1 40.89,6.73 41.15,6.99 41.15,7.37 41.78,8 43.18,8 43.81,8.64 43.81,9.91 43.18,10.54 40.77,10.54 40.01,11.3 JP2.1 39.62,14.61 37.63,14.61 37.29,14.95 37.18,14.95 | 30.23,39.75 30.23,40.51 29.72,41.02 22.48,41.02 21.99,40.53 C20.1 21.99,34.89 C14.2 21.97,34.43 21.97,33.78 21.21,33.02 16.26,33.02 R10.1 15.88,35.56 15.11,36.32 9.02,36.32 8.38,36.96 8.38,39.75 7.62,40.51 3.94,40.51 3.3,41.15 3.3,47.5 4.68,48.87 X1.3 6.3,48.9 4.7,48.9 3.3,50.29 3.3,57.66 4.7,59.05 6.3,59.05 X2.2 | 30.23,39.75 R19.1 30.23,32.26 31.24,31.24 33.02,31.24 | C5.2 64.12,30.08 64.64,30.61 64.64,39.24 64.14,39.75 C2.1 62.34,40.91 61.85,41.4 50.93,41.4 50.44,40.91 C1.1 48.77,39.75 48.13,39.12 48.13,32.38 48.77,31.75 52.32,31.75 53.09,30.99 v53.09,29.59 54.74,29.59 | L1.1 30.31,39.84 30.23,39.75 | R14.2 59.98,53.81 59.56,54.23 56.64,54.23 56.26,53.85 | C25.2 52.05,49.39 53.09,50.42 55.88,50.42 56.26,50.8 56.26,53.85 | 56.26,53.85 55.88,54.23 IC2.4 54.86,58.28 C13.- | PRG_SW.2 41.2,32.64 34.54,32.64 33.15,31.24 33.02,31.24
  Bottom 0.406: 33.02,31.24 33.66,30.61 C6.2 | 37.18,14.95 36.7,14.48 36.7,14.37 C3.2 | 37.18,14.95 37.18,15.92 RST_SW.4 | 28.57,3.17 28.96,2.79 71.37,2.79 72.26,3.68 v72.26,13.97 72.26,28.32 v70.99,29.59 | v62.74,13.97 61.09,13.97
  Bottom 0.61: v11.56,50.67 11.56,49.66 10.77,48.87 X1.3
  Bottom 0.813: X2.2 22.59,59.03 | 22.59,59.03 C24.- | 22.59,59.03 23.62,58 C26.+ C7.- | C7.- 34.54,59.56 U6.2 34.54,66.04 35.56,67.06 57.28,67.06 58.29,66.04 58.29,59.05 57.51,58.27 U2.1 51.55,58.27 C11.1 54.89,58.31 C13.- | C7.- C12.1
GND1
  Bottom 0.406: L1.2 31.85,37.73 C10.2 33.92,37.47 35.18,37.47 U7.7 37.45,36.7 C27.2
LCD_CONT
  Bottom 0.305: R8.3 31.11,8.64 31.75,8 40.51,8 41.78,9.27 JP1.4
LCD_D4
  Bottom 0.254: JP1.5 45.59,6.73 46.86,8 48.39,8 48.9,8.51 48.9,10.16 49.28,10.54 52.96,10.54 53.85,11.43 53.85,13.08 55.14,14.38 U1.33
LCD_D5
  Bottom 0.254: JP1.8 47.62,10.03 48.64,11.05 52.45,11.05 53.34,11.94 53.34,13.34 54.63,14.63 U1.34
LCD_D6
  Bottom 0.254: JP1.3 43.05,6.73 44.32,8 45.47,8 46.23,8.76 46.23,10.41 47.37,11.56 51.82,11.56 52.83,12.57 52.83,13.59 54.13,14.88 U1.35
LCD_D7
  Bottom 0.254: U1.36 53.65,15.16 52.32,13.84 52.32,13.08 51.31,12.06 46.61,12.06 45.09,10.54 JP1.6
LCD_EN
  Bottom 0.254: U1.31 56.13,13.84 54.86,12.57 54.86,9.53 53.34,8 49.66,8 48.9,7.24 48.13,7.24 JP1.7
LCD_R/W
  Bottom 0.254: JP1.10 52.83,9.27 54.36,10.79 54.36,12.83 55.63,14.1 U1.32
LCD_RS
  Bottom 0.254: JP1.9 53.47,6.73 55.37,8.64 55.37,12.32 56.64,13.59 U1.30
LDAC
  Bottom 0.254: U7.5 35.94,43.31 36.45,43.81 46.48,43.81 46.99,43.31 64.64,43.31 65.91,42.04 65.91,29.97 64.9,28.96 62.99,28.96 62.61,28.57 62.61,23.24 62.08,22.71 U1.14
LED1
  Bottom 0.254: U1.16 62.71,21.69 63.63,22.61 63.63,27.56 64.01,27.94 65.53,27.94 66.93,29.34 66.93,44.7 65.91,45.72 R4.2
LED2
  Bottom 0.254: U1.15 62.46,22.2 63.12,22.86 63.12,28.07 63.5,28.45 65.28,28.45 66.42,29.59 66.42,44.26 R5.2
N$1
  Bottom 0.406: R4.1 LED1.C
N$2
  Bottom 0.406: R5.1 LED2.C
N$4
  Bottom 0.406: RST_SW.2 36.33,20.55 R2.1 32.98,17.2 R1.2 32.98,15.29 C3.1
N$5
  Bottom 0.406: R6.1 33.6,27.52 C6.1 34.8,27.56 35.43,28.19 37.08,28.19 38.52,26.76 R7.2 42.56,26.76 PRG_SW.4
N$6
  Bottom 0.406: R3.2 C2.2 60.34,35.67 60.58,35.43 | 60.58,35.43 24MHZ.2 | R24.2 57.91,33.27 59.56,34.92 60.07,34.92 60.58,35.43
N$7  (1 unrouted)
  Bottom 0.406: IC2.3 52.23,51.69 52.23,54.23 R25.2
N$11
  Bottom 0.406: 33.92,40.01 C10.1 | C10.1 33.66,40.51 34.29,41.15 34.29,42.42 34.67,42.8 34.67,45.21 34.16,45.72 L2.1 | C10.1 34.69,39.73 35.18,39.24 U7.6 39.5,39.24 40.26,38.48 40.26,34.31 40.13,34.18 | C27.1 40.13,34.18 | 40.13,34.18 43.55,34.18 U7.1
N$12
  Bottom 0.305: U4.14 17.4,15.11 16.76,14.48 7.49,14.48 7.37,14.35 7.36,14.35 X4.2
N$13
  Bottom 0.305: U4.12 14.86,15.62 14.48,15.24 9.65,15.24 9.27,15.62 9.27,18.03 8.89,18.41 6.35,18.41 X4.3
N$14
  Bottom 0.305: U4.1 19.94,8.74 C17.+
N$15
  Bottom 0.254: R15.2 57.88,49.99 C23.1 | C23.1 57.93,52.27 R14.1 | IC2.2 57.04,49.15 C23.1
N$16
  Bottom 0.406: 17.91,39.62 IC5.2 16.38,39.62 15.88,40.13 R10.2 R9.1
N$17
  Bottom 0.305: 20.32,43.69 19.68,43.05 19.68,37.59 19.18,37.08 IC5.3
  Bottom 0.406: R11.1 R19.2 29.72,43.18 27.05,43.18 26.54,43.69 20.32,43.69
N$20
  Bottom 0.813: X2.3 14.1,64.11 D2.C
N$21
  Bottom 0.813: X2.1 6.33,55.47 7.11,56.26 16.89,56.26 17.65,55.5 D1.A
N$24
  Bottom 0.305: C17.- 20.04,5.59 18.54,5.59 18.16,5.97 18.16,9.91 17.4,10.67 U4.3
N$26
  Bottom 0.305: U4.4 16.13,10.67 17.27,9.53 17.27,6.1 16.79,5.61 C18.+
N$27
  Bottom 0.305: U4.5 14.86,10.79 15.37,10.29 C18.-
N$28
  Bottom 0.305: U4.2 18.67,13.08 19.05,13.46 22.1,13.46 22.48,13.08 22.48,6.1 22.96,5.61 C16.+
N$29
  Bottom 0.305: 10.67,8.89 C15.- 10.82,8.76 12.95,8.76 13.59,9.4 U4.6
N$33
  Bottom 0.406: IC5.6 25.02,37.08 24.51,36.58 24.51,32.13 23.24,30.86 14.1,30.86 13.21,31.75 R9.2 12.85,33.63 X3.3
N$37
  Bottom 0.406: R26.2 49.87,51.69 IC2.6 44.16,51.69 R18.2
PULSE
  Bottom 0.406: D5.C R18.1
RS485_RX_EN
  Bottom 0.254: U5.2 22.99,20.83 23.24,20.57 26.8,20.57 27.3,21.08 27.3,22.86 27.81,23.37 48.39,23.37 50.06,21.69 U1.45
RS485_TX_EN
  Bottom 0.254: U5.3 21.72,21.21 22.48,20.45 22.48,19.18 21.72,18.41 20.19,18.41 19.43,19.18 19.43,23.24 21.08,24.89 49.28,24.89 50.98,23.19 U1.48
SENSOR_SIGNAL  (via drill 0.7 pad 1.42)
  Top 0.406: v24.38,47.75 v34.67,47.75
  Bottom 0.406: X1.2 8.38,45.85 13.46,45.85 15.37,47.75 v24.38,47.75 | R17.1 39.62,52.32 | 39.62,52.32 R16.2 35.6,50.96 34.67,50.04 v34.67,47.75 | R25.1 50,53.18 49.78,52.96 41.66,52.96 41.02,52.32 39.62,52.32
SPI1_CS
  Bottom 0.254: U1.2 54.13,25.63 53.85,25.91 50.67,25.91 50.29,26.29 46.99,26.29 45.85,27.43 45.85,36.07 45.21,36.7 U7.2
SPI1_MOSI  (via drill 0.7 pad 1.42)
  Top 0.406: v48.13,29.59 v48.13,17.3
  Bottom 0.254: U7.4 45.85,41.78 46.48,41.15 46.48,30.23 | U1.38 49.02,18.19
  Bottom 0.406: 49.02,18.19 v48.13,17.3 | 46.48,30.23 47.12,29.59 v48.13,29.59
SPI1_SCK
  Bottom 0.254: U7.3 42.55,39.24 42.29,39.5 42.29,42.8 42.8,43.31 46.1,43.31 46.61,42.8 64.39,42.8 65.02,42.16 65.41,41.78 65.41,30.23 64.64,29.46 62.48,29.46 62.1,29.08 62.1,23.5 61.8,23.19 U1.13
SWDCLK
  Bottom 0.254: U1.29 57.15,17.27 56.9,17.53 53.47,17.53 52.58,16.64 52.58,16.13 50.8,14.35 47.5,14.35 JP2.6
SWDIO
  Bottom 0.254: U1.39 52.17,18.67 50.16,18.67 49.91,18.92 42.93,18.92 42.55,18.54 JP2.4
SWITCH0
  Bottom 0.254: U1.28 57.63,11.79 JP3.1
  Bottom 0.406: R23.2 JP3.1
SWITCH1
  Bottom 0.254: U1.27 58.14,12.09 JP3.2
  Bottom 0.406: R22.2 JP3.2
SWITCH2
  Bottom 0.254: 61.85,11.18 JP3.3 61.85,11.81 59.13,14.53 U1.25
  Bottom 0.406: R21.2 JP3.3
SWITCH3
  Bottom 0.254: U1.24 61.8,17.7 64.39,15.11 JP3.4
  Bottom 0.406: R20.2 JP3.4
SWITCH4
  Bottom 0.254: U1.23 62.2,18.19 66.93,13.46 JP3.5
  Bottom 0.406: R13.2 JP3.5
SWITCH5
  Bottom 0.254: U1.22 62.71,18.69 69.47,11.94 JP3.6
  Bottom 0.406: R12.2 JP3.6
UART_RX  (via drill 0.7 pad 1.42)
  Top 0.406: v18.03,21.84 v26.04,21.84
  Bottom 0.254: 24.33,22.23 U5.1 | 24.36,22.2 U5.1 | 15.62,20.07 16.13,20.57 16.38,20.57 | 24.38,21.84 24.26,21.72 U5.1 | U1.46 50.32,22.2 48.64,23.88 26.67,23.88 26.04,23.24
  Bottom 0.305: U4.13 16.13,19.56 15.62,20.07 14.73,20.07 14.35,20.45 U8.2
  Bottom 0.406: v18.03,21.84 17.65,21.84 16.38,20.57 | v26.04,21.84 24.38,21.84
  Bottom 0.61: 26.04,23.24 v26.04,21.84
UART_TX  (via drill 0.7 pad 1.42)
  Top 0.305: v13.08,19.81 v21.21,19.81
  Bottom 0.254: U1.47 50.57,22.71 48.9,24.38 21.46,24.38 20.45,23.37 U5.4 20.45,20.57
  Bottom 0.406: U4.11 13.59,19.3 v13.08,19.81 U8.3 | 20.45,20.57 v21.21,19.81
VCC  (via drill 0.7 pad 1.42)
  Top 0.406: v29.21,27.94 v29.21,21.84 | v35.18,4.7 v35.18,11.68 | v54.86,64.77 v61.09,64.77
  Bottom 0.254: 60.18,28.07 C5.1 60.2,26.92 59.94,26.67 57.4,26.67 57.15,26.42 U1.8 57.15,21.59 56.77,21.21 U1.44 48.75,21.21 C4.1 48.51,20.97 48.51,22.35 48.01,22.86 40.64,22.86 40.01,22.23 | JP2.2 40.01,22.23 | 30.86,22.35 31.37,22.86 39.37,22.86 40.01,22.23
  Bottom 0.406: R12.1 R13.1 R20.1 R21.1 R22.1 R23.1 53.81,6.06 53.21,5.46 35.94,5.46 v35.18,4.7 | LED2.A LED1.A | R12.1 | v29.21,27.94 29.21,28.83 29.97,29.59 31.21,29.59 R6.2 | R12.1 70.36,6.06 71.12,6.82 71.12,12.45 66.04,17.53 66.04,27.18 67.82,28.96 67.82,52.96 67.28,53.5 LED2.A | 30.35,21.84 v29.21,21.84 29.21,14.73 29.97,13.97 31.24,13.97 33.53,11.68 v35.18,11.68 | 30.35,21.84 30.86,22.35 | R2.2 32.89,19.3 30.35,21.84 | LED2.A 63.37,64.01 62.61,64.77 v61.09,64.77
  Bottom 0.813: 47.23,60.31 C11.2 52.6,61.32 C13.+ 54.9,64.74 v54.86,64.77 | 47.23,60.31 46.61,59.69 U2.2 | 47.23,60.31 47.13,60.31 46.61,60.83 U2.4
XTAL_IN
  Bottom 0.254: U1.6 56.13,32 | 53.21,34.92 52.45,34.92 52.44,34.91
  Bottom 0.406: 24MHZ.1 51.69,34.67 52.2,34.67 52.44,34.91 C1.2 R3.1 | 56.13,32 53.21,34.92
XTAL_OUT
  Bottom 0.254: U1.7 56.64,27.56 57.02,27.94 57.82,27.94 R24.1
(copper drawn outside any net)
  shapes: Bottom area x2